# EAGLE design regulador_potencia_2 (EAGLE 6.6.0)
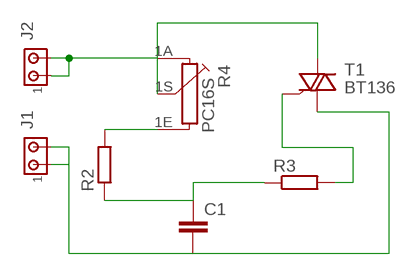
[diagram p0: schematic, sheet 1]

## Parts
C1  C2.5/5  [C2.5-5]
J1  MTA02-156  [1X2MTA]
J2  MTA02-156  [1X2MTA]
R2  R-EU_0207/12  [0207/12]
R3  R-EU_0207/12  [0207/12]
R4  PC16S  [PC16S]
T1  BT136  [TO220AB]

## Nets
N$1: R2.2 R4.1E
N$2: J2.1 J2.2 R4.1A R4.1S T1.2(A2)
N$3: C1.2 J1.1 J1.2 T1.1(A1)
N$4: C1.1 R2.1 R3.1
N$5: R3.2 T1.3(G)

## Library data of the parts
C1 = capacitor-wima:C: CAPACITOR naming: grid - package width
J1 J2 = con-amp:MTA02-156: AMP connector
R2 R3 = resistor:R-EU_: RESISTOR, European symbol
R4 = piher:PC16S: POTENTIOMETER single carbon potentiometer, 16 mm, S3ROH; OC_FARNELL: 4452940; OC_NEWARK: unknown
T1 = triac:BT136: Triac BT136 series E sensitive gate Source: http://www.nxp.com/acrobat_download/datasheets/BT136_SERIES_E_2.pdf

## Board
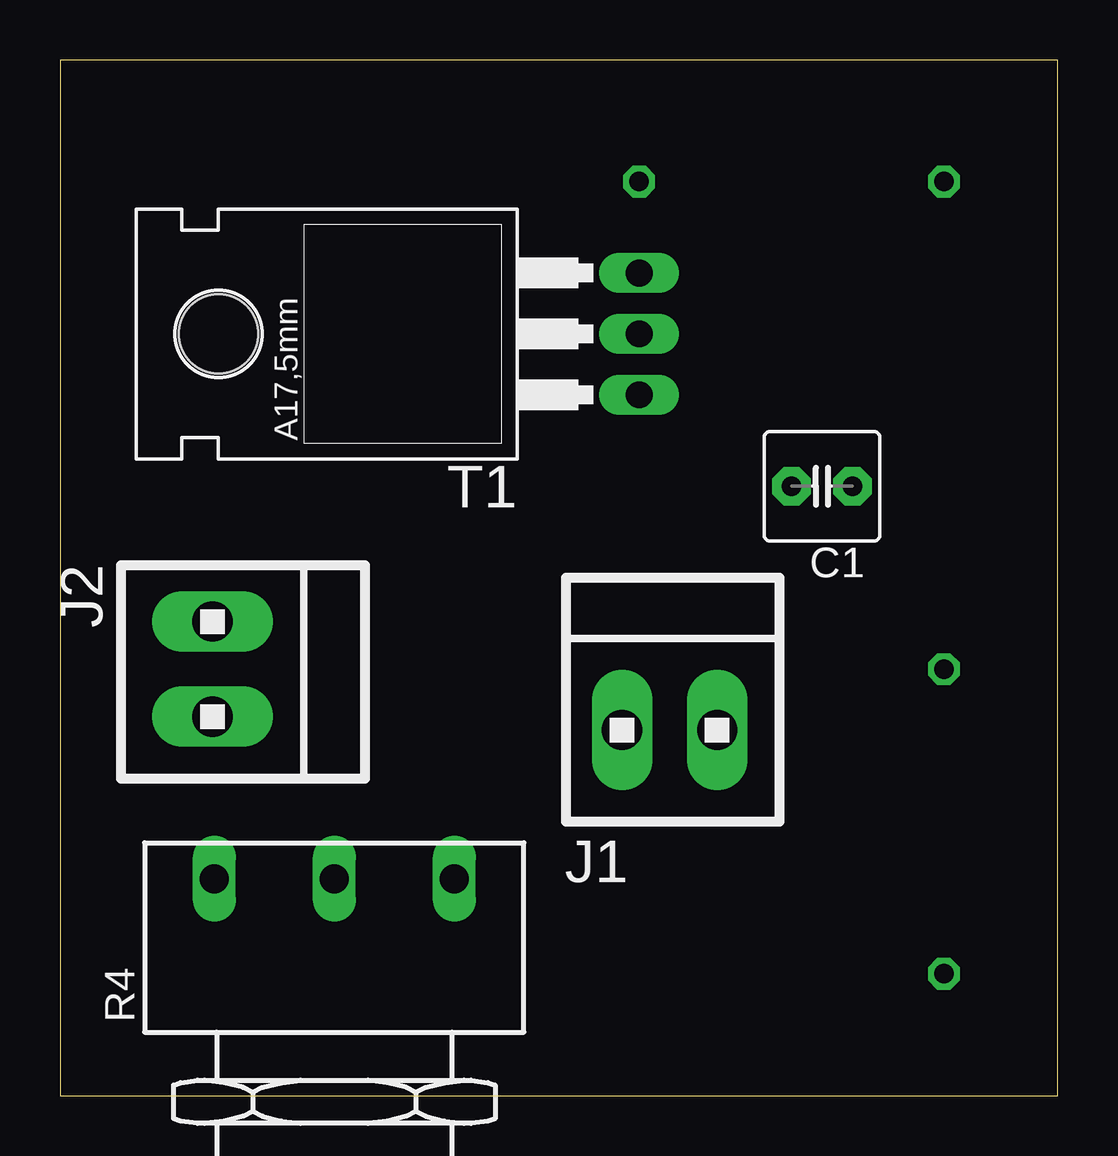
[diagram p1: board, top side]
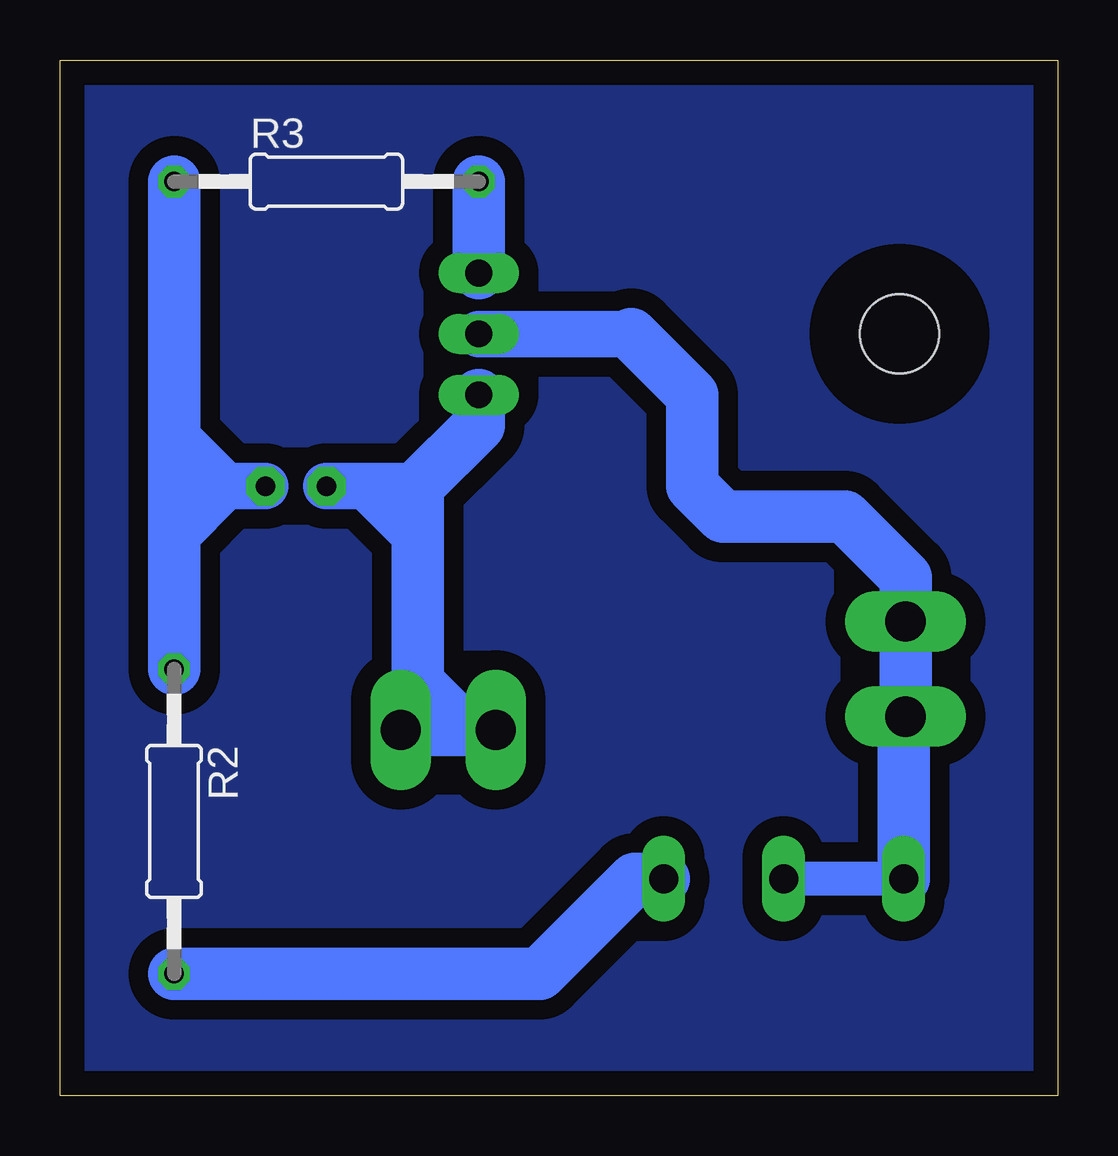
[diagram p2: board, bottom side, seen from below]

Size 41.58 x 43.17 mm. Coordinates in mm from the lower left corner, seen from the top.
Outline: 0,0 41.58,0 41.58,43.17 0,43.17 0,0
Copper layers (1*16): Top 0.035mm / dielectric 1.5mm / Bottom 0.035mm
Design rules "default": minimum track width 10mil, minimum drill 24mil, track to track 8mil, track to pad 8mil, pad to pad 8mil, via to via 8mil, smd to smd 8mil, copper to edge 40mil, drill to drill 8mil, minimum pad ring 10mil, minimum via ring 8mil, stop-mask expansion 4mil, vias tented up to drill 0mil, thermal gap 10mil

### Footprints (pad centres in the part's own frame; a part is rotated, then mirrored left to right if it is on the bottom)
C2.5-5 = drill 0.813 pad 1.6 octagon: 1 -1.27,0; 2 1.27,0
1X2MTA = drill 1.676 long: 1 1.981,0; 2 -1.981,0
0207/12 = drill 0.813 octagon: 1 -6.35,0; 2 6.35,0
PC16S = drill 1.2 long: 1A -5,6.5; 1E 5,6.5; 1S 0,6.5
TO220AB = drill 1.118 long: 1 -2.54,-6.35; 2 0,-6.35; 3 2.54,-6.35 | hole 3.302: 0,11.176

### Placement (x,y rotation side)
C1  31.75,25.4 180 top
J1  25.4,15.24 0 top
J2  6.35,17.78 270 top
R2  36.83,11.43 270 bottom
R3  30.48,38.1 0 bottom
R4  11.43,2.54 0 top
T1  17.78,31.75 90 top

### Tracks (layer width: path | path; a pad name or v marks a point on that pad's centre or on a via)
N$1
  Bottom 2.184: R4.1E 17.63,9.04 21.59,5.08 R2.2
N$2
  Bottom 1.422: R4.1A R4.1S
  Bottom 1.93: 17.78,31.75 T1.2
  Bottom 2.184: R4.1A 6.43,15.72 J2.1 J2.2 6.35,21.59 8.89,24.13 13.97,24.13 15.24,25.4 15.24,29.21 17.78,31.75
N$3
  Bottom 1.422: 24.13,15.24 26.67,17.78 | 26.67,22.86 29.21,25.4
  Bottom 1.93: 26.67,25.4 29.21,25.4 C1.2
  Bottom 2.184: T1.1 24.13,27.94 26.67,25.4 26.67,22.86 26.67,17.78 26.67,15.95 J1.1 24.13,15.24 J1.2
N$4
  Bottom 1.422: 36.83,22.86 34.29,25.4 36.83,27.94
  Bottom 1.93: C1.1 34.29,25.4 36.83,25.4
  Bottom 2.184: R2.1 36.83,22.86 36.83,25.4 36.83,27.94 R3.1
N$5
  Bottom 2.184: R3.2 T1.3
N$6
  pour Bottom (isolate 0.813): 0,43.18 41.91,43.18 41.91,0 0,0